# Altium project MPLAB-ICD-Inline.PrjPcb
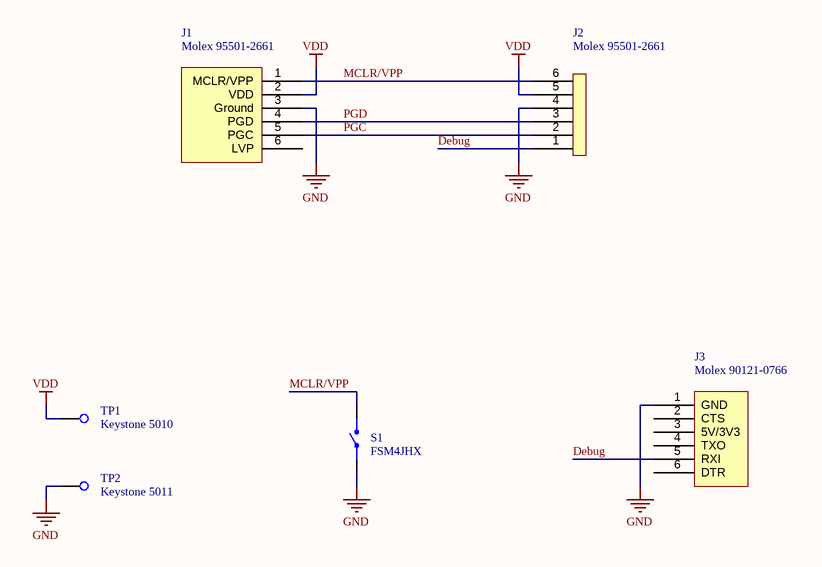
[diagram p0: MPLAB-ICD-Inline.SchDoc]
Version: v1.0; Project: MPLAB-ICD-Inline; Author: Seb Madgwick
1 sheet, 6 parts. Net scope: global (net labels, ports and power ports of the same name join across sheets).
Board file: MPLAB-ICD-Inline.PcbDoc

## Sheet MPLAB-ICD-Inline.SchDoc
size A4; SheetNumber: 1; SheetTotal: 1

### Parts
J1  Molex 95501-2661  [Molex 95501-2661]
J2  Molex 95501-2661  [Molex 95501-2661]
J3  Molex 90121-0766  [Molex 90121-0766 with FTDI Breakout]
S1  FSM4JHX  [FSM4JHX]
TP1  Keystone 5010  [Keystone 5010]
TP2  Keystone 5011  [Keystone 5011]

### Nets
GND: J1.3(Ground) J2.4 J3.1(GND) S1.1 TP2.1
VDD: J1.2(VDD) J2.5 TP1.1
Debug: J2.1 J3.5(RXI)
MCLR/VPP: J1.1(MCLR/VPP) J2.6 S1.2
PGC: J1.5(PGC) J2.2
PGD: J1.4(PGD) J2.3

Not connected (* = marked no-connect by the designer): J1 6(LVP); J3 2(CTS) 3(5V/3V3) 4(TXO) 6(DTR)

### Notes on the sheet
- TITLE
- SIZE
- A4
- VARIANT
- PROJECT
- SHEET
- VERSION
- OF
- AUTHOR
- DATE

### Library data of the parts
J1 = MPLAB ICSP
J3 = FTDI Breakout
S1 = Switch
TP1 TP2 = Test Point